# Altium project BBB_Board.PrjPCB (part 2 of 2)
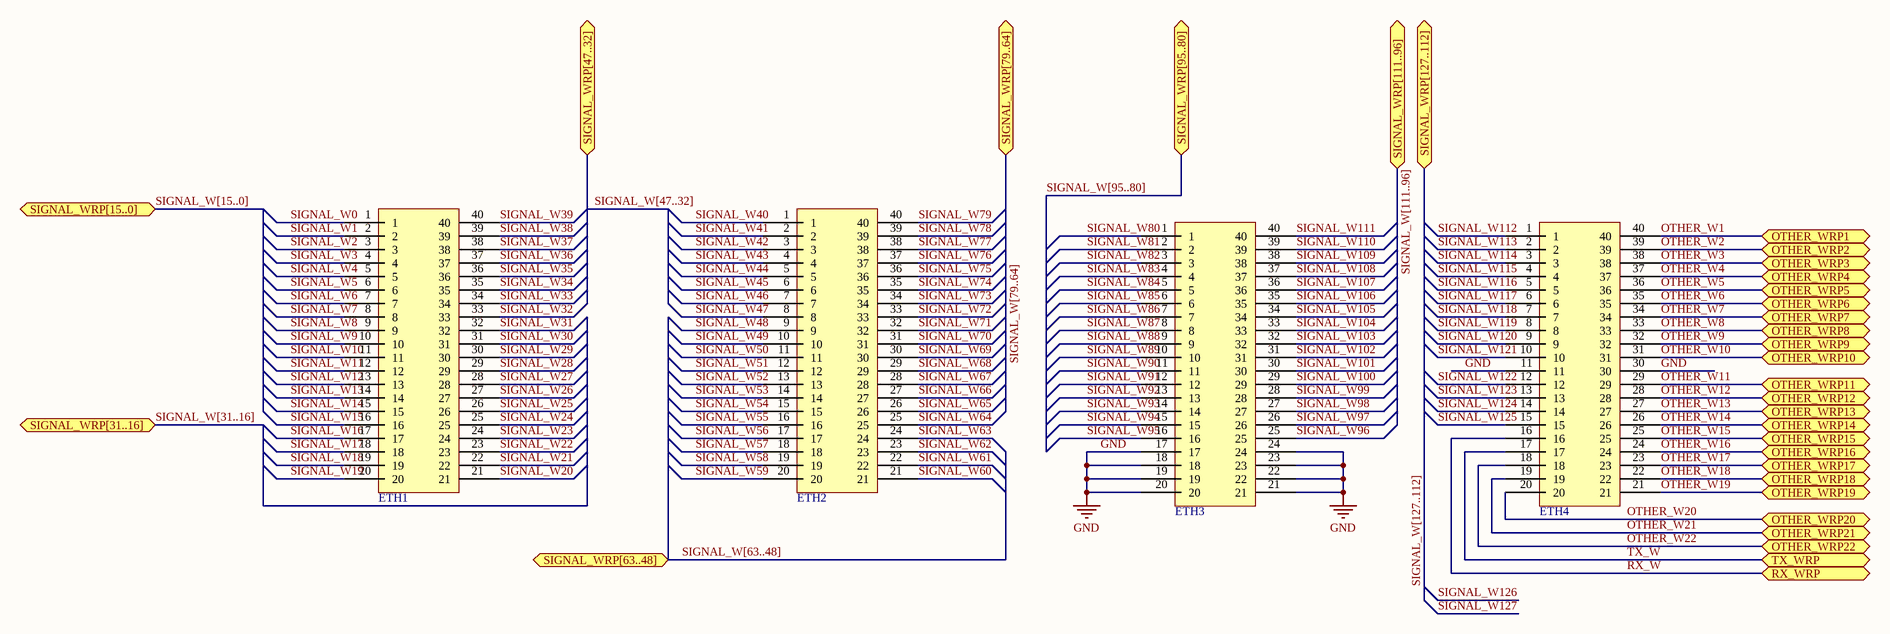
[diagram p6: NUMATO_HDR.SchDoc]

## Nets that join several sheets
GND: BBB_Board (50 pins), U_Power_Control (10 pins), U_Power_Control (10 pins), U_DUT_HEADER (DUT1_U_DUT_HEADER4.20 DUT1_U_DUT_HEADER4.21), U_DUT_HEADER (DUT1_U_DUT_HEADER2.20 DUT1_U_DUT_HEADER2.21 DUT1_U_DUT_HEADER2.22), U_DUT_HEADER (5 pins), NUMATO_HDR (10 pins)
3V3_W: BBB_Board (14 pins), U_Power_Control (0.1uF_4_U_Power_Control2.2 10k_U_Power_Control2.2 10uF_1_U_Power_Control2.2 POT_U_Power_Control2.8), U_Power_Control (0.1uF_4_U_Power_Control1.2 10k_U_Power_Control1.2 10uF_1_U_Power_Control1.2 POT_U_Power_Control1.8), U_VT_BANK/U_VT_WRP (0.1uF_0_U_VT_WRP8.1 LT1_U_VT_WRP8.2 LT2_U_VT_WRP8.2), U_VT_BANK/U_VT_WRP (0.1uF_0_U_VT_WRP7.1 LT1_U_VT_WRP7.2 LT2_U_VT_WRP7.2), U_VT_BANK/U_VT_WRP (0.1uF_0_U_VT_WRP6.1 LT1_U_VT_WRP6.2 LT2_U_VT_WRP6.2), U_VT_BANK/U_VT_WRP (0.1uF_0_U_VT_WRP5.1 LT1_U_VT_WRP5.2 LT2_U_VT_WRP5.2), U_VT_BANK/U_VT_WRP (0.1uF_0_U_VT_WRP4.1 LT1_U_VT_WRP4.2 LT2_U_VT_WRP4.2), U_VT_BANK/U_VT_WRP (0.1uF_0_U_VT_WRP3.1 LT1_U_VT_WRP3.2 LT2_U_VT_WRP3.2), U_VT_BANK/U_VT_WRP (0.1uF_0_U_VT_WRP2.1 LT1_U_VT_WRP2.2 LT2_U_VT_WRP2.2), U_VT_BANK/U_VT_WRP (0.1uF_0_U_VT_WRP1.1 LT1_U_VT_WRP1.2 LT2_U_VT_WRP1.2), U_DUT_HEADER (DUT1_U_DUT_HEADER2.19)
12V_W: BBB_Board (5 pins), U_Power_Control (5 pins), U_Power_Control (5 pins)
-5V_W: BBB_Board (5V_INVERTER.5 150uF_1.2), U_Power_Control (3MOhm_U_Power_Control2.2 LM1_U_Power_Control2.2), U_Power_Control (3MOhm_U_Power_Control1.2 LM1_U_Power_Control1.2)
COUNTER_CLK0: U_DUT_HEADER (DUT1_U_DUT_HEADER4.24), NUMATO_HDR (ETH4.35)
COUNTER_CLK1: U_DUT_HEADER (DUT1_U_DUT_HEADER3.24), NUMATO_HDR (ETH4.25)
COUNTER_CLK2: U_DUT_HEADER (DUT1_U_DUT_HEADER2.24), NUMATO_HDR (ETH4.22)
COUNTER_CLK3: U_DUT_HEADER (DUT1_U_DUT_HEADER1.24), NUMATO_HDR (ETH4.21)
COUNTER_CLR: U_DUT_HEADER (DUT1_U_DUT_HEADER4.23), NUMATO_HDR (ETH4.36)
CUSTOM_HIGH: BBB_Board (CUSTOM_HIGH.1), U_Power_Control (6 pins)
CUSTOM_LOW: BBB_Board (CUSTOM_LOW.1), U_Power_Control (6 pins)
DIN0: BBB_Board (BBB_DOWN.21), U_Power_Control (POT_U_Power_Control2.10)
DIN1: BBB_Board (BBB_DOWN.29), U_Power_Control (POT_U_Power_Control1.10)
FPGA_EN: U_VT_BANK/U_VT_WRP (LT1_U_VT_WRP8.10 LT2_U_VT_WRP8.10), U_VT_BANK/U_VT_WRP (LT1_U_VT_WRP7.10 LT2_U_VT_WRP7.10), U_VT_BANK/U_VT_WRP (LT1_U_VT_WRP6.10 LT2_U_VT_WRP6.10), U_VT_BANK/U_VT_WRP (LT1_U_VT_WRP5.10 LT2_U_VT_WRP5.10), U_VT_BANK/U_VT_WRP (LT1_U_VT_WRP4.10 LT2_U_VT_WRP4.10), U_VT_BANK/U_VT_WRP (LT1_U_VT_WRP3.10 LT2_U_VT_WRP3.10), U_VT_BANK/U_VT_WRP (LT1_U_VT_WRP2.10 LT2_U_VT_WRP2.10), U_VT_BANK/U_VT_WRP (LT1_U_VT_WRP1.10 LT2_U_VT_WRP1.10), U_DUT_HEADER (DUT1_U_DUT_HEADER4.22), NUMATO_HDR (ETH4.37)
FPGA_Q: U_DUT_HEADER (DUT1_U_DUT_HEADER3.20), NUMATO_HDR (ETH4.18)
FPGA_RX: BBB_Board (BBB_DOWN.26), NUMATO_HDR (ETH4.16)
FPGA_SHCP: U_DUT_HEADER (DUT1_U_DUT_HEADER3.22), NUMATO_HDR (ETH4.29)
FPGA_SIG0: U_VT_BANK/U_VT_WRP (LT1_U_VT_WRP8.1), NUMATO_HDR (ETH1.1)
FPGA_SIG1: U_VT_BANK/U_VT_WRP (LT1_U_VT_WRP8.3), NUMATO_HDR (ETH1.2)
FPGA_SIG2: U_VT_BANK/U_VT_WRP (LT1_U_VT_WRP8.4), NUMATO_HDR (ETH1.3)
FPGA_SIG3: U_VT_BANK/U_VT_WRP (LT1_U_VT_WRP8.5), NUMATO_HDR (ETH1.4)
FPGA_SIG4: U_VT_BANK/U_VT_WRP (LT1_U_VT_WRP8.6), NUMATO_HDR (ETH1.5)
FPGA_SIG5: U_VT_BANK/U_VT_WRP (LT1_U_VT_WRP8.7), NUMATO_HDR (ETH1.6)
FPGA_SIG6: U_VT_BANK/U_VT_WRP (LT1_U_VT_WRP8.8), NUMATO_HDR (ETH1.7)
FPGA_SIG7: U_VT_BANK/U_VT_WRP (LT1_U_VT_WRP8.9), NUMATO_HDR (ETH1.8)
FPGA_SIG8: U_VT_BANK/U_VT_WRP (LT2_U_VT_WRP8.1), NUMATO_HDR (ETH1.9)
FPGA_SIG9: U_VT_BANK/U_VT_WRP (LT2_U_VT_WRP8.3), NUMATO_HDR (ETH1.10)
FPGA_SIG10: U_VT_BANK/U_VT_WRP (LT2_U_VT_WRP8.4), NUMATO_HDR (ETH1.11)
FPGA_SIG11: U_VT_BANK/U_VT_WRP (LT2_U_VT_WRP8.5), NUMATO_HDR (ETH1.12)
FPGA_SIG12: U_VT_BANK/U_VT_WRP (LT2_U_VT_WRP8.6), NUMATO_HDR (ETH1.13)
FPGA_SIG13: U_VT_BANK/U_VT_WRP (LT2_U_VT_WRP8.7), NUMATO_HDR (ETH1.14)
FPGA_SIG14: U_VT_BANK/U_VT_WRP (LT2_U_VT_WRP8.8), NUMATO_HDR (ETH1.15)
FPGA_SIG15: U_VT_BANK/U_VT_WRP (LT2_U_VT_WRP8.9), NUMATO_HDR (ETH1.16)
FPGA_SIG16: U_VT_BANK/U_VT_WRP (LT1_U_VT_WRP7.1), NUMATO_HDR (ETH1.17)
FPGA_SIG17: U_VT_BANK/U_VT_WRP (LT1_U_VT_WRP7.3), NUMATO_HDR (ETH1.18)
FPGA_SIG18: U_VT_BANK/U_VT_WRP (LT1_U_VT_WRP7.4), NUMATO_HDR (ETH1.19)
FPGA_SIG19: U_VT_BANK/U_VT_WRP (LT1_U_VT_WRP7.5), NUMATO_HDR (ETH1.20)
FPGA_SIG20: U_VT_BANK/U_VT_WRP (LT1_U_VT_WRP7.6), NUMATO_HDR (ETH1.21)
FPGA_SIG21: U_VT_BANK/U_VT_WRP (LT1_U_VT_WRP7.7), NUMATO_HDR (ETH1.22)
FPGA_SIG22: U_VT_BANK/U_VT_WRP (LT1_U_VT_WRP7.8), NUMATO_HDR (ETH1.23)
FPGA_SIG23: U_VT_BANK/U_VT_WRP (LT1_U_VT_WRP7.9), NUMATO_HDR (ETH1.24)
FPGA_SIG24: U_VT_BANK/U_VT_WRP (LT2_U_VT_WRP7.1), NUMATO_HDR (ETH1.25)
FPGA_SIG25: U_VT_BANK/U_VT_WRP (LT2_U_VT_WRP7.3), NUMATO_HDR (ETH1.26)
FPGA_SIG26: U_VT_BANK/U_VT_WRP (LT2_U_VT_WRP7.4), NUMATO_HDR (ETH1.27)
FPGA_SIG27: U_VT_BANK/U_VT_WRP (LT2_U_VT_WRP7.5), NUMATO_HDR (ETH1.28)
FPGA_SIG28: U_VT_BANK/U_VT_WRP (LT2_U_VT_WRP7.6), NUMATO_HDR (ETH1.29)
FPGA_SIG29: U_VT_BANK/U_VT_WRP (LT2_U_VT_WRP7.7), NUMATO_HDR (ETH1.30)
FPGA_SIG30: U_VT_BANK/U_VT_WRP (LT2_U_VT_WRP7.8), NUMATO_HDR (ETH1.31)
FPGA_SIG31: U_VT_BANK/U_VT_WRP (LT2_U_VT_WRP7.9), NUMATO_HDR (ETH1.32)
FPGA_SIG32: U_VT_BANK/U_VT_WRP (LT1_U_VT_WRP6.1), NUMATO_HDR (ETH1.33)
FPGA_SIG33: U_VT_BANK/U_VT_WRP (LT1_U_VT_WRP6.3), NUMATO_HDR (ETH1.34)
FPGA_SIG34: U_VT_BANK/U_VT_WRP (LT1_U_VT_WRP6.4), NUMATO_HDR (ETH1.35)
FPGA_SIG35: U_VT_BANK/U_VT_WRP (LT1_U_VT_WRP6.5), NUMATO_HDR (ETH1.36)
FPGA_SIG36: U_VT_BANK/U_VT_WRP (LT1_U_VT_WRP6.6), NUMATO_HDR (ETH1.37)
FPGA_SIG37: U_VT_BANK/U_VT_WRP (LT1_U_VT_WRP6.7), NUMATO_HDR (ETH1.38)
FPGA_SIG38: U_VT_BANK/U_VT_WRP (LT1_U_VT_WRP6.8), NUMATO_HDR (ETH1.39)
FPGA_SIG39: U_VT_BANK/U_VT_WRP (LT1_U_VT_WRP6.9), NUMATO_HDR (ETH1.40)
FPGA_SIG40: U_VT_BANK/U_VT_WRP (LT2_U_VT_WRP6.1), NUMATO_HDR (ETH2.1)
FPGA_SIG41: U_VT_BANK/U_VT_WRP (LT2_U_VT_WRP6.3), NUMATO_HDR (ETH2.2)
FPGA_SIG42: U_VT_BANK/U_VT_WRP (LT2_U_VT_WRP6.4), NUMATO_HDR (ETH2.3)
FPGA_SIG43: U_VT_BANK/U_VT_WRP (LT2_U_VT_WRP6.5), NUMATO_HDR (ETH2.4)
FPGA_SIG44: U_VT_BANK/U_VT_WRP (LT2_U_VT_WRP6.6), NUMATO_HDR (ETH2.5)
FPGA_SIG45: U_VT_BANK/U_VT_WRP (LT2_U_VT_WRP6.7), NUMATO_HDR (ETH2.6)
FPGA_SIG46: U_VT_BANK/U_VT_WRP (LT2_U_VT_WRP6.8), NUMATO_HDR (ETH2.7)
FPGA_SIG47: U_VT_BANK/U_VT_WRP (LT2_U_VT_WRP6.9), NUMATO_HDR (ETH2.8)
FPGA_SIG48: U_VT_BANK/U_VT_WRP (LT1_U_VT_WRP5.1), NUMATO_HDR (ETH2.9)
FPGA_SIG49: U_VT_BANK/U_VT_WRP (LT1_U_VT_WRP5.3), NUMATO_HDR (ETH2.10)
FPGA_SIG50: U_VT_BANK/U_VT_WRP (LT1_U_VT_WRP5.4), NUMATO_HDR (ETH2.11)
FPGA_SIG51: U_VT_BANK/U_VT_WRP (LT1_U_VT_WRP5.5), NUMATO_HDR (ETH2.12)
FPGA_SIG52: U_VT_BANK/U_VT_WRP (LT1_U_VT_WRP5.6), NUMATO_HDR (ETH2.13)
FPGA_SIG53: U_VT_BANK/U_VT_WRP (LT1_U_VT_WRP5.7), NUMATO_HDR (ETH2.14)
FPGA_SIG54: U_VT_BANK/U_VT_WRP (LT1_U_VT_WRP5.8), NUMATO_HDR (ETH2.15)
FPGA_SIG55: U_VT_BANK/U_VT_WRP (LT1_U_VT_WRP5.9), NUMATO_HDR (ETH2.16)
FPGA_SIG56: U_VT_BANK/U_VT_WRP (LT2_U_VT_WRP5.1), NUMATO_HDR (ETH2.17)
FPGA_SIG57: U_VT_BANK/U_VT_WRP (LT2_U_VT_WRP5.3), NUMATO_HDR (ETH2.18)
FPGA_SIG58: U_VT_BANK/U_VT_WRP (LT2_U_VT_WRP5.4), NUMATO_HDR (ETH2.19)
FPGA_SIG59: U_VT_BANK/U_VT_WRP (LT2_U_VT_WRP5.5), NUMATO_HDR (ETH2.20)
FPGA_SIG60: U_VT_BANK/U_VT_WRP (LT2_U_VT_WRP5.6), NUMATO_HDR (ETH2.21)
FPGA_SIG61: U_VT_BANK/U_VT_WRP (LT2_U_VT_WRP5.7), NUMATO_HDR (ETH2.22)
FPGA_SIG62: U_VT_BANK/U_VT_WRP (LT2_U_VT_WRP5.8), NUMATO_HDR (ETH2.23)
FPGA_SIG63: U_VT_BANK/U_VT_WRP (LT2_U_VT_WRP5.9), NUMATO_HDR (ETH2.24)
FPGA_SIG64: U_VT_BANK/U_VT_WRP (LT1_U_VT_WRP4.1), NUMATO_HDR (ETH2.25)
FPGA_SIG65: U_VT_BANK/U_VT_WRP (LT1_U_VT_WRP4.3), NUMATO_HDR (ETH2.26)
FPGA_SIG66: U_VT_BANK/U_VT_WRP (LT1_U_VT_WRP4.4), NUMATO_HDR (ETH2.27)
FPGA_SIG67: U_VT_BANK/U_VT_WRP (LT1_U_VT_WRP4.5), NUMATO_HDR (ETH2.28)
FPGA_SIG68: U_VT_BANK/U_VT_WRP (LT1_U_VT_WRP4.6), NUMATO_HDR (ETH2.29)
FPGA_SIG69: U_VT_BANK/U_VT_WRP (LT1_U_VT_WRP4.7), NUMATO_HDR (ETH2.30)
FPGA_SIG70: U_VT_BANK/U_VT_WRP (LT1_U_VT_WRP4.8), NUMATO_HDR (ETH2.31)
FPGA_SIG71: U_VT_BANK/U_VT_WRP (LT1_U_VT_WRP4.9), NUMATO_HDR (ETH2.32)
FPGA_SIG72: U_VT_BANK/U_VT_WRP (LT2_U_VT_WRP4.1), NUMATO_HDR (ETH2.33)
FPGA_SIG73: U_VT_BANK/U_VT_WRP (LT2_U_VT_WRP4.3), NUMATO_HDR (ETH2.34)
FPGA_SIG74: U_VT_BANK/U_VT_WRP (LT2_U_VT_WRP4.4), NUMATO_HDR (ETH2.35)
FPGA_SIG75: U_VT_BANK/U_VT_WRP (LT2_U_VT_WRP4.5), NUMATO_HDR (ETH2.36)
FPGA_SIG76: U_VT_BANK/U_VT_WRP (LT2_U_VT_WRP4.6), NUMATO_HDR (ETH2.37)
FPGA_SIG77: U_VT_BANK/U_VT_WRP (LT2_U_VT_WRP4.7), NUMATO_HDR (ETH2.38)
FPGA_SIG78: U_VT_BANK/U_VT_WRP (LT2_U_VT_WRP4.8), NUMATO_HDR (ETH2.39)
FPGA_SIG79: U_VT_BANK/U_VT_WRP (LT2_U_VT_WRP4.9), NUMATO_HDR (ETH2.40)
FPGA_SIG80: U_VT_BANK/U_VT_WRP (LT1_U_VT_WRP3.1), NUMATO_HDR (ETH3.1)
FPGA_SIG81: U_VT_BANK/U_VT_WRP (LT1_U_VT_WRP3.3), NUMATO_HDR (ETH3.2)
FPGA_SIG82: U_VT_BANK/U_VT_WRP (LT1_U_VT_WRP3.4), NUMATO_HDR (ETH3.3)
FPGA_SIG83: U_VT_BANK/U_VT_WRP (LT1_U_VT_WRP3.5), NUMATO_HDR (ETH3.4)
FPGA_SIG84: U_VT_BANK/U_VT_WRP (LT1_U_VT_WRP3.6), NUMATO_HDR (ETH3.5)
FPGA_SIG85: U_VT_BANK/U_VT_WRP (LT1_U_VT_WRP3.7), NUMATO_HDR (ETH3.6)
FPGA_SIG86: U_VT_BANK/U_VT_WRP (LT1_U_VT_WRP3.8), NUMATO_HDR (ETH3.7)
FPGA_SIG87: U_VT_BANK/U_VT_WRP (LT1_U_VT_WRP3.9), NUMATO_HDR (ETH3.8)
FPGA_SIG88: U_VT_BANK/U_VT_WRP (LT2_U_VT_WRP3.1), NUMATO_HDR (ETH3.9)
FPGA_SIG89: U_VT_BANK/U_VT_WRP (LT2_U_VT_WRP3.3), NUMATO_HDR (ETH3.10)
FPGA_SIG90: U_VT_BANK/U_VT_WRP (LT2_U_VT_WRP3.4), NUMATO_HDR (ETH3.11)
FPGA_SIG91: U_VT_BANK/U_VT_WRP (LT2_U_VT_WRP3.5), NUMATO_HDR (ETH3.12)
FPGA_SIG92: U_VT_BANK/U_VT_WRP (LT2_U_VT_WRP3.6), NUMATO_HDR (ETH3.13)
FPGA_SIG93: U_VT_BANK/U_VT_WRP (LT2_U_VT_WRP3.7), NUMATO_HDR (ETH3.14)
FPGA_SIG94: U_VT_BANK/U_VT_WRP (LT2_U_VT_WRP3.8), NUMATO_HDR (ETH3.15)
FPGA_SIG95: U_VT_BANK/U_VT_WRP (LT2_U_VT_WRP3.9), NUMATO_HDR (ETH3.16)
FPGA_SIG96: U_VT_BANK/U_VT_WRP (LT1_U_VT_WRP2.1), NUMATO_HDR (ETH3.25)
FPGA_SIG97: U_VT_BANK/U_VT_WRP (LT1_U_VT_WRP2.3), NUMATO_HDR (ETH3.26)
FPGA_SIG98: U_VT_BANK/U_VT_WRP (LT1_U_VT_WRP2.4), NUMATO_HDR (ETH3.27)
FPGA_SIG99: U_VT_BANK/U_VT_WRP (LT1_U_VT_WRP2.5), NUMATO_HDR (ETH3.28)
FPGA_SIG100: U_VT_BANK/U_VT_WRP (LT1_U_VT_WRP2.6), NUMATO_HDR (ETH3.29)
FPGA_SIG101: U_VT_BANK/U_VT_WRP (LT1_U_VT_WRP2.7), NUMATO_HDR (ETH3.30)
FPGA_SIG102: U_VT_BANK/U_VT_WRP (LT1_U_VT_WRP2.8), NUMATO_HDR (ETH3.31)
FPGA_SIG103: U_VT_BANK/U_VT_WRP (LT1_U_VT_WRP2.9), NUMATO_HDR (ETH3.32)
FPGA_SIG104: U_VT_BANK/U_VT_WRP (LT2_U_VT_WRP2.1), NUMATO_HDR (ETH3.33)
FPGA_SIG105: U_VT_BANK/U_VT_WRP (LT2_U_VT_WRP2.3), NUMATO_HDR (ETH3.34)
FPGA_SIG106: U_VT_BANK/U_VT_WRP (LT2_U_VT_WRP2.4), NUMATO_HDR (ETH3.35)
FPGA_SIG107: U_VT_BANK/U_VT_WRP (LT2_U_VT_WRP2.5), NUMATO_HDR (ETH3.36)
FPGA_SIG108: U_VT_BANK/U_VT_WRP (LT2_U_VT_WRP2.6), NUMATO_HDR (ETH3.37)
FPGA_SIG109: U_VT_BANK/U_VT_WRP (LT2_U_VT_WRP2.7), NUMATO_HDR (ETH3.38)
FPGA_SIG110: U_VT_BANK/U_VT_WRP (LT2_U_VT_WRP2.8), NUMATO_HDR (ETH3.39)
FPGA_SIG111: U_VT_BANK/U_VT_WRP (LT2_U_VT_WRP2.9), NUMATO_HDR (ETH3.40)
FPGA_SIG112: U_VT_BANK/U_VT_WRP (LT1_U_VT_WRP1.1), NUMATO_HDR (ETH4.1)
FPGA_SIG113: U_VT_BANK/U_VT_WRP (LT1_U_VT_WRP1.3), NUMATO_HDR (ETH4.2)
FPGA_SIG114: U_VT_BANK/U_VT_WRP (LT1_U_VT_WRP1.4), NUMATO_HDR (ETH4.3)
FPGA_SIG115: U_VT_BANK/U_VT_WRP (LT1_U_VT_WRP1.5), NUMATO_HDR (ETH4.4)
FPGA_SIG116: U_VT_BANK/U_VT_WRP (LT1_U_VT_WRP1.6), NUMATO_HDR (ETH4.5)
FPGA_SIG117: U_VT_BANK/U_VT_WRP (LT1_U_VT_WRP1.7), NUMATO_HDR (ETH4.6)
FPGA_SIG118: U_VT_BANK/U_VT_WRP (LT1_U_VT_WRP1.8), NUMATO_HDR (ETH4.7)
FPGA_SIG119: U_VT_BANK/U_VT_WRP (LT1_U_VT_WRP1.9), NUMATO_HDR (ETH4.8)
FPGA_SIG120: U_VT_BANK/U_VT_WRP (LT2_U_VT_WRP1.1), NUMATO_HDR (ETH4.9)
FPGA_SIG121: U_VT_BANK/U_VT_WRP (LT2_U_VT_WRP1.3), NUMATO_HDR (ETH4.10)
FPGA_SIG122: U_VT_BANK/U_VT_WRP (LT2_U_VT_WRP1.4), NUMATO_HDR (ETH4.12)
FPGA_SIG123: U_VT_BANK/U_VT_WRP (LT2_U_VT_WRP1.5), NUMATO_HDR (ETH4.13)
FPGA_SIG124: U_VT_BANK/U_VT_WRP (LT2_U_VT_WRP1.6), NUMATO_HDR (ETH4.14)
FPGA_SIG125: U_VT_BANK/U_VT_WRP (LT2_U_VT_WRP1.7), NUMATO_HDR (ETH4.15)
FPGA_STCP: U_DUT_HEADER (DUT1_U_DUT_HEADER3.23), NUMATO_HDR (ETH4.28)
FPGA_TX: BBB_Board (BBB_DOWN.24), NUMATO_HDR (ETH4.17)
FPGA_~CS1: U_DUT_HEADER (DUT1_U_DUT_HEADER4.17), NUMATO_HDR (ETH4.40)
FPGA_~CS2: U_DUT_HEADER (DUT1_U_DUT_HEADER2.17), NUMATO_HDR (ETH4.27)
FPGA_~CS3: U_DUT_HEADER (DUT1_U_DUT_HEADER1.17), NUMATO_HDR (ETH4.24)
FPGA_~CS4: U_DUT_HEADER (DUT1_U_DUT_HEADER3.17), NUMATO_HDR (ETH4.34)
FPGA_~MR: U_DUT_HEADER (DUT1_U_DUT_HEADER3.19), NUMATO_HDR (ETH4.32)
FPGA_~OE: U_DUT_HEADER (DUT1_U_DUT_HEADER4.18), NUMATO_HDR (ETH4.39)
FPGA_~PL: U_DUT_HEADER (DUT1_U_DUT_HEADER3.21), NUMATO_HDR (ETH4.31)
FPGA_~WE1: U_DUT_HEADER (DUT1_U_DUT_HEADER4.19), NUMATO_HDR (ETH4.38)
FPGA_~WE2: U_DUT_HEADER (DUT1_U_DUT_HEADER2.18), NUMATO_HDR (ETH4.26)
FPGA_~WE3: U_DUT_HEADER (DUT1_U_DUT_HEADER1.18), NUMATO_HDR (ETH4.23)
FPGA_~WE4: U_DUT_HEADER (DUT1_U_DUT_HEADER3.18), NUMATO_HDR (ETH4.33)
GLOBAL_HIGH_POWER: BBB_Board (11 pins), U_VT_BANK/U_VT_WRP (0.1uF_4_U_VT_WRP8.1 LT1_U_VT_WRP8.19 LT2_U_VT_WRP8.19), U_VT_BANK/U_VT_WRP (0.1uF_4_U_VT_WRP7.1 LT1_U_VT_WRP7.19 LT2_U_VT_WRP7.19), U_VT_BANK/U_VT_WRP (0.1uF_4_U_VT_WRP6.1 LT1_U_VT_WRP6.19 LT2_U_VT_WRP6.19), U_VT_BANK/U_VT_WRP (0.1uF_4_U_VT_WRP5.1 LT1_U_VT_WRP5.19 LT2_U_VT_WRP5.19), U_VT_BANK/U_VT_WRP (0.1uF_4_U_VT_WRP4.1 LT1_U_VT_WRP4.19 LT2_U_VT_WRP4.19), U_VT_BANK/U_VT_WRP (0.1uF_4_U_VT_WRP3.1 LT1_U_VT_WRP3.19 LT2_U_VT_WRP3.19), U_VT_BANK/U_VT_WRP (0.1uF_4_U_VT_WRP2.1 LT1_U_VT_WRP2.19 LT2_U_VT_WRP2.19), U_VT_BANK/U_VT_WRP (0.1uF_4_U_VT_WRP1.1 LT1_U_VT_WRP1.19 LT2_U_VT_WRP1.19), U_DUT_HEADER (DUT1_U_DUT_HEADER2.23)
GLOBAL_LOW_POWER: BBB_Board (11 pins), U_VT_BANK/U_VT_WRP (0.1uF_0_U_VT_WRP8.2 0.1uF_4_U_VT_WRP8.2 LT1_U_VT_WRP8.11 LT2_U_VT_WRP8.11), U_VT_BANK/U_VT_WRP (0.1uF_0_U_VT_WRP7.2 0.1uF_4_U_VT_WRP7.2 LT1_U_VT_WRP7.11 LT2_U_VT_WRP7.11), U_VT_BANK/U_VT_WRP (0.1uF_0_U_VT_WRP6.2 0.1uF_4_U_VT_WRP6.2 LT1_U_VT_WRP6.11 LT2_U_VT_WRP6.11), U_VT_BANK/U_VT_WRP (0.1uF_0_U_VT_WRP5.2 0.1uF_4_U_VT_WRP5.2 LT1_U_VT_WRP5.11 LT2_U_VT_WRP5.11), U_VT_BANK/U_VT_WRP (0.1uF_0_U_VT_WRP4.2 0.1uF_4_U_VT_WRP4.2 LT1_U_VT_WRP4.11 LT2_U_VT_WRP4.11), U_VT_BANK/U_VT_WRP (0.1uF_0_U_VT_WRP3.2 0.1uF_4_U_VT_WRP3.2 LT1_U_VT_WRP3.11 LT2_U_VT_WRP3.11), U_VT_BANK/U_VT_WRP (0.1uF_0_U_VT_WRP2.2 0.1uF_4_U_VT_WRP2.2 LT1_U_VT_WRP2.11 LT2_U_VT_WRP2.11), U_VT_BANK/U_VT_WRP (0.1uF_0_U_VT_WRP1.2 0.1uF_4_U_VT_WRP1.2 LT1_U_VT_WRP1.11 LT2_U_VT_WRP1.11)
OTHER_W21: BBB_Board (R1.2 S1.2), NUMATO_HDR (ETH4.19)
OVCC_B0: U_VT_BANK/U_VT_WRP (LT1_U_VT_WRP8.20), U_DUT_HEADER (DUT1_U_DUT_HEADER4.1)
OVCC_B1: U_VT_BANK/U_VT_WRP (LT1_U_VT_WRP8.18), U_DUT_HEADER (DUT1_U_DUT_HEADER4.2)
OVCC_B2: U_VT_BANK/U_VT_WRP (LT1_U_VT_WRP8.17), U_DUT_HEADER (DUT1_U_DUT_HEADER4.3)
OVCC_B3: U_VT_BANK/U_VT_WRP (LT1_U_VT_WRP8.16), U_DUT_HEADER (DUT1_U_DUT_HEADER4.4)
OVCC_B4: U_VT_BANK/U_VT_WRP (LT1_U_VT_WRP8.15), U_DUT_HEADER (DUT1_U_DUT_HEADER4.5)
OVCC_B5: U_VT_BANK/U_VT_WRP (LT1_U_VT_WRP8.14), U_DUT_HEADER (DUT1_U_DUT_HEADER4.6)
OVCC_B6: U_VT_BANK/U_VT_WRP (LT1_U_VT_WRP8.13), U_DUT_HEADER (DUT1_U_DUT_HEADER4.7)
OVCC_B7: U_VT_BANK/U_VT_WRP (LT1_U_VT_WRP8.12), U_DUT_HEADER (DUT1_U_DUT_HEADER4.8)
OVCC_B8: U_VT_BANK/U_VT_WRP (LT2_U_VT_WRP8.20), U_DUT_HEADER (DUT1_U_DUT_HEADER4.9)
OVCC_B9: U_VT_BANK/U_VT_WRP (LT2_U_VT_WRP8.18), U_DUT_HEADER (DUT1_U_DUT_HEADER4.10)
OVCC_B10: U_VT_BANK/U_VT_WRP (LT2_U_VT_WRP8.17), U_DUT_HEADER (DUT1_U_DUT_HEADER4.11)
OVCC_B11: U_VT_BANK/U_VT_WRP (LT2_U_VT_WRP8.16), U_DUT_HEADER (DUT1_U_DUT_HEADER4.12)
OVCC_B12: U_VT_BANK/U_VT_WRP (LT2_U_VT_WRP8.15), U_DUT_HEADER (DUT1_U_DUT_HEADER4.13)
OVCC_B13: U_VT_BANK/U_VT_WRP (LT2_U_VT_WRP8.14), U_DUT_HEADER (DUT1_U_DUT_HEADER4.14)
OVCC_B14: U_VT_BANK/U_VT_WRP (LT2_U_VT_WRP8.13), U_DUT_HEADER (DUT1_U_DUT_HEADER4.15)
OVCC_B15: U_VT_BANK/U_VT_WRP (LT2_U_VT_WRP8.12), U_DUT_HEADER (DUT1_U_DUT_HEADER4.16)
OVCC_B16: U_VT_BANK/U_VT_WRP (LT1_U_VT_WRP7.20), U_DUT_HEADER (DUT1_U_DUT_HEADER4.25)
OVCC_B17: U_VT_BANK/U_VT_WRP (LT1_U_VT_WRP7.18), U_DUT_HEADER (DUT1_U_DUT_HEADER4.26)
OVCC_B18: U_VT_BANK/U_VT_WRP (LT1_U_VT_WRP7.17), U_DUT_HEADER (DUT1_U_DUT_HEADER4.27)
OVCC_B19: U_VT_BANK/U_VT_WRP (LT1_U_VT_WRP7.16), U_DUT_HEADER (DUT1_U_DUT_HEADER4.28)
OVCC_B20: U_VT_BANK/U_VT_WRP (LT1_U_VT_WRP7.15), U_DUT_HEADER (DUT1_U_DUT_HEADER4.29)
OVCC_B21: U_VT_BANK/U_VT_WRP (LT1_U_VT_WRP7.14), U_DUT_HEADER (DUT1_U_DUT_HEADER4.30)
OVCC_B22: U_VT_BANK/U_VT_WRP (LT1_U_VT_WRP7.13), U_DUT_HEADER (DUT1_U_DUT_HEADER4.31)
OVCC_B23: U_VT_BANK/U_VT_WRP (LT1_U_VT_WRP7.12), U_DUT_HEADER (DUT1_U_DUT_HEADER4.32)
OVCC_B24: U_VT_BANK/U_VT_WRP (LT2_U_VT_WRP7.20), U_DUT_HEADER (DUT1_U_DUT_HEADER4.33)
OVCC_B25: U_VT_BANK/U_VT_WRP (LT2_U_VT_WRP7.18), U_DUT_HEADER (DUT1_U_DUT_HEADER4.34)
OVCC_B26: U_VT_BANK/U_VT_WRP (LT2_U_VT_WRP7.17), U_DUT_HEADER (DUT1_U_DUT_HEADER4.35)
OVCC_B27: U_VT_BANK/U_VT_WRP (LT2_U_VT_WRP7.16), U_DUT_HEADER (DUT1_U_DUT_HEADER4.36)
OVCC_B28: U_VT_BANK/U_VT_WRP (LT2_U_VT_WRP7.15), U_DUT_HEADER (DUT1_U_DUT_HEADER4.37)
OVCC_B29: U_VT_BANK/U_VT_WRP (LT2_U_VT_WRP7.14), U_DUT_HEADER (DUT1_U_DUT_HEADER4.38)
OVCC_B30: U_VT_BANK/U_VT_WRP (LT2_U_VT_WRP7.13), U_DUT_HEADER (DUT1_U_DUT_HEADER4.39)
OVCC_B31: U_VT_BANK/U_VT_WRP (LT2_U_VT_WRP7.12), U_DUT_HEADER (DUT1_U_DUT_HEADER4.40)
OVCC_B32: U_VT_BANK/U_VT_WRP (LT1_U_VT_WRP6.20), U_DUT_HEADER (DUT1_U_DUT_HEADER3.1)
OVCC_B33: U_VT_BANK/U_VT_WRP (LT1_U_VT_WRP6.18), U_DUT_HEADER (DUT1_U_DUT_HEADER3.2)
OVCC_B34: U_VT_BANK/U_VT_WRP (LT1_U_VT_WRP6.17), U_DUT_HEADER (DUT1_U_DUT_HEADER3.3)
OVCC_B35: U_VT_BANK/U_VT_WRP (LT1_U_VT_WRP6.16), U_DUT_HEADER (DUT1_U_DUT_HEADER3.4)
OVCC_B36: U_VT_BANK/U_VT_WRP (LT1_U_VT_WRP6.15), U_DUT_HEADER (DUT1_U_DUT_HEADER3.5)
OVCC_B37: U_VT_BANK/U_VT_WRP (LT1_U_VT_WRP6.14), U_DUT_HEADER (DUT1_U_DUT_HEADER3.6)
OVCC_B38: U_VT_BANK/U_VT_WRP (LT1_U_VT_WRP6.13), U_DUT_HEADER (DUT1_U_DUT_HEADER3.7)
OVCC_B39: U_VT_BANK/U_VT_WRP (LT1_U_VT_WRP6.12), U_DUT_HEADER (DUT1_U_DUT_HEADER3.8)
OVCC_B40: U_VT_BANK/U_VT_WRP (LT2_U_VT_WRP6.20), U_DUT_HEADER (DUT1_U_DUT_HEADER3.9)
OVCC_B41: U_VT_BANK/U_VT_WRP (LT2_U_VT_WRP6.18), U_DUT_HEADER (DUT1_U_DUT_HEADER3.10)
OVCC_B42: U_VT_BANK/U_VT_WRP (LT2_U_VT_WRP6.17), U_DUT_HEADER (DUT1_U_DUT_HEADER3.11)
OVCC_B43: U_VT_BANK/U_VT_WRP (LT2_U_VT_WRP6.16), U_DUT_HEADER (DUT1_U_DUT_HEADER3.12)
OVCC_B44: U_VT_BANK/U_VT_WRP (LT2_U_VT_WRP6.15), U_DUT_HEADER (DUT1_U_DUT_HEADER3.13)
OVCC_B45: U_VT_BANK/U_VT_WRP (LT2_U_VT_WRP6.14), U_DUT_HEADER (DUT1_U_DUT_HEADER3.14)
OVCC_B46: U_VT_BANK/U_VT_WRP (LT2_U_VT_WRP6.13), U_DUT_HEADER (DUT1_U_DUT_HEADER3.15)
OVCC_B47: U_VT_BANK/U_VT_WRP (LT2_U_VT_WRP6.12), U_DUT_HEADER (DUT1_U_DUT_HEADER3.16)
OVCC_B48: U_VT_BANK/U_VT_WRP (LT1_U_VT_WRP5.20), U_DUT_HEADER (DUT1_U_DUT_HEADER3.25)
OVCC_B49: U_VT_BANK/U_VT_WRP (LT1_U_VT_WRP5.18), U_DUT_HEADER (DUT1_U_DUT_HEADER3.26)
OVCC_B50: U_VT_BANK/U_VT_WRP (LT1_U_VT_WRP5.17), U_DUT_HEADER (DUT1_U_DUT_HEADER3.27)
OVCC_B51: U_VT_BANK/U_VT_WRP (LT1_U_VT_WRP5.16), U_DUT_HEADER (DUT1_U_DUT_HEADER3.28)
OVCC_B52: U_VT_BANK/U_VT_WRP (LT1_U_VT_WRP5.15), U_DUT_HEADER (DUT1_U_DUT_HEADER3.29)
OVCC_B53: U_VT_BANK/U_VT_WRP (LT1_U_VT_WRP5.14), U_DUT_HEADER (DUT1_U_DUT_HEADER3.30)
OVCC_B54: U_VT_BANK/U_VT_WRP (LT1_U_VT_WRP5.13), U_DUT_HEADER (DUT1_U_DUT_HEADER3.31)
OVCC_B55: U_VT_BANK/U_VT_WRP (LT1_U_VT_WRP5.12), U_DUT_HEADER (DUT1_U_DUT_HEADER3.32)
OVCC_B56: U_VT_BANK/U_VT_WRP (LT2_U_VT_WRP5.20), U_DUT_HEADER (DUT1_U_DUT_HEADER3.33)
OVCC_B57: U_VT_BANK/U_VT_WRP (LT2_U_VT_WRP5.18), U_DUT_HEADER (DUT1_U_DUT_HEADER3.34)
OVCC_B58: U_VT_BANK/U_VT_WRP (LT2_U_VT_WRP5.17), U_DUT_HEADER (DUT1_U_DUT_HEADER3.35)
OVCC_B59: U_VT_BANK/U_VT_WRP (LT2_U_VT_WRP5.16), U_DUT_HEADER (DUT1_U_DUT_HEADER3.36)
OVCC_B60: U_VT_BANK/U_VT_WRP (LT2_U_VT_WRP5.15), U_DUT_HEADER (DUT1_U_DUT_HEADER3.37)
OVCC_B61: U_VT_BANK/U_VT_WRP (LT2_U_VT_WRP5.14), U_DUT_HEADER (DUT1_U_DUT_HEADER3.38)
OVCC_B62: U_VT_BANK/U_VT_WRP (LT2_U_VT_WRP5.13), U_DUT_HEADER (DUT1_U_DUT_HEADER3.39)
OVCC_B63: U_VT_BANK/U_VT_WRP (LT2_U_VT_WRP5.12), U_DUT_HEADER (DUT1_U_DUT_HEADER3.40)
OVCC_B64: U_VT_BANK/U_VT_WRP (LT1_U_VT_WRP4.20), U_DUT_HEADER (DUT1_U_DUT_HEADER2.1)
OVCC_B65: U_VT_BANK/U_VT_WRP (LT1_U_VT_WRP4.18), U_DUT_HEADER (DUT1_U_DUT_HEADER2.2)
OVCC_B66: U_VT_BANK/U_VT_WRP (LT1_U_VT_WRP4.17), U_DUT_HEADER (DUT1_U_DUT_HEADER2.3)
OVCC_B67: U_VT_BANK/U_VT_WRP (LT1_U_VT_WRP4.16), U_DUT_HEADER (DUT1_U_DUT_HEADER2.4)
OVCC_B68: U_VT_BANK/U_VT_WRP (LT1_U_VT_WRP4.15), U_DUT_HEADER (DUT1_U_DUT_HEADER2.5)
OVCC_B69: U_VT_BANK/U_VT_WRP (LT1_U_VT_WRP4.14), U_DUT_HEADER (DUT1_U_DUT_HEADER2.6)
OVCC_B70: U_VT_BANK/U_VT_WRP (LT1_U_VT_WRP4.13), U_DUT_HEADER (DUT1_U_DUT_HEADER2.7)
OVCC_B71: U_VT_BANK/U_VT_WRP (LT1_U_VT_WRP4.12), U_DUT_HEADER (DUT1_U_DUT_HEADER2.8)
OVCC_B72: U_VT_BANK/U_VT_WRP (LT2_U_VT_WRP4.20), U_DUT_HEADER (DUT1_U_DUT_HEADER2.9)
OVCC_B73: U_VT_BANK/U_VT_WRP (LT2_U_VT_WRP4.18), U_DUT_HEADER (DUT1_U_DUT_HEADER2.10)
OVCC_B74: U_VT_BANK/U_VT_WRP (LT2_U_VT_WRP4.17), U_DUT_HEADER (DUT1_U_DUT_HEADER2.11)
OVCC_B75: U_VT_BANK/U_VT_WRP (LT2_U_VT_WRP4.16), U_DUT_HEADER (DUT1_U_DUT_HEADER2.12)
OVCC_B76: U_VT_BANK/U_VT_WRP (LT2_U_VT_WRP4.15), U_DUT_HEADER (DUT1_U_DUT_HEADER2.13)
OVCC_B77: U_VT_BANK/U_VT_WRP (LT2_U_VT_WRP4.14), U_DUT_HEADER (DUT1_U_DUT_HEADER2.14)
OVCC_B78: U_VT_BANK/U_VT_WRP (LT2_U_VT_WRP4.13), U_DUT_HEADER (DUT1_U_DUT_HEADER2.15)
OVCC_B79: U_VT_BANK/U_VT_WRP (LT2_U_VT_WRP4.12), U_DUT_HEADER (DUT1_U_DUT_HEADER2.16)
OVCC_B80: U_VT_BANK/U_VT_WRP (LT1_U_VT_WRP3.20), U_DUT_HEADER (DUT1_U_DUT_HEADER2.25)
OVCC_B81: U_VT_BANK/U_VT_WRP (LT1_U_VT_WRP3.18), U_DUT_HEADER (DUT1_U_DUT_HEADER2.26)
OVCC_B82: U_VT_BANK/U_VT_WRP (LT1_U_VT_WRP3.17), U_DUT_HEADER (DUT1_U_DUT_HEADER2.27)
OVCC_B83: U_VT_BANK/U_VT_WRP (LT1_U_VT_WRP3.16), U_DUT_HEADER (DUT1_U_DUT_HEADER2.28)
OVCC_B84: U_VT_BANK/U_VT_WRP (LT1_U_VT_WRP3.15), U_DUT_HEADER (DUT1_U_DUT_HEADER2.29)
OVCC_B85: U_VT_BANK/U_VT_WRP (LT1_U_VT_WRP3.14), U_DUT_HEADER (DUT1_U_DUT_HEADER2.30)
OVCC_B86: U_VT_BANK/U_VT_WRP (LT1_U_VT_WRP3.13), U_DUT_HEADER (DUT1_U_DUT_HEADER2.31)
OVCC_B87: U_VT_BANK/U_VT_WRP (LT1_U_VT_WRP3.12), U_DUT_HEADER (DUT1_U_DUT_HEADER2.32)
OVCC_B88: U_VT_BANK/U_VT_WRP (LT2_U_VT_WRP3.20), U_DUT_HEADER (DUT1_U_DUT_HEADER2.33)
OVCC_B89: U_VT_BANK/U_VT_WRP (LT2_U_VT_WRP3.18), U_DUT_HEADER (DUT1_U_DUT_HEADER2.34)
OVCC_B90: U_VT_BANK/U_VT_WRP (LT2_U_VT_WRP3.17), U_DUT_HEADER (DUT1_U_DUT_HEADER2.35)
OVCC_B91: U_VT_BANK/U_VT_WRP (LT2_U_VT_WRP3.16), U_DUT_HEADER (DUT1_U_DUT_HEADER2.36)
OVCC_B92: U_VT_BANK/U_VT_WRP (LT2_U_VT_WRP3.15), U_DUT_HEADER (DUT1_U_DUT_HEADER2.37)
OVCC_B93: U_VT_BANK/U_VT_WRP (LT2_U_VT_WRP3.14), U_DUT_HEADER (DUT1_U_DUT_HEADER2.38)
OVCC_B94: U_VT_BANK/U_VT_WRP (LT2_U_VT_WRP3.13), U_DUT_HEADER (DUT1_U_DUT_HEADER2.39)
OVCC_B95: U_VT_BANK/U_VT_WRP (LT2_U_VT_WRP3.12), U_DUT_HEADER (DUT1_U_DUT_HEADER2.40)
OVCC_B96: U_VT_BANK/U_VT_WRP (LT1_U_VT_WRP2.20), U_DUT_HEADER (DUT1_U_DUT_HEADER1.1)
OVCC_B97: U_VT_BANK/U_VT_WRP (LT1_U_VT_WRP2.18), U_DUT_HEADER (DUT1_U_DUT_HEADER1.2)
OVCC_B98: U_VT_BANK/U_VT_WRP (LT1_U_VT_WRP2.17), U_DUT_HEADER (DUT1_U_DUT_HEADER1.3)
OVCC_B99: U_VT_BANK/U_VT_WRP (LT1_U_VT_WRP2.16), U_DUT_HEADER (DUT1_U_DUT_HEADER1.4)
OVCC_B100: U_VT_BANK/U_VT_WRP (LT1_U_VT_WRP2.15), U_DUT_HEADER (DUT1_U_DUT_HEADER1.5)
OVCC_B101: U_VT_BANK/U_VT_WRP (LT1_U_VT_WRP2.14), U_DUT_HEADER (DUT1_U_DUT_HEADER1.6)
OVCC_B102: U_VT_BANK/U_VT_WRP (LT1_U_VT_WRP2.13), U_DUT_HEADER (DUT1_U_DUT_HEADER1.7)
OVCC_B103: U_VT_BANK/U_VT_WRP (LT1_U_VT_WRP2.12), U_DUT_HEADER (DUT1_U_DUT_HEADER1.8)
OVCC_B104: U_VT_BANK/U_VT_WRP (LT2_U_VT_WRP2.20), U_DUT_HEADER (DUT1_U_DUT_HEADER1.9)
OVCC_B105: U_VT_BANK/U_VT_WRP (LT2_U_VT_WRP2.18), U_DUT_HEADER (DUT1_U_DUT_HEADER1.10)
OVCC_B106: U_VT_BANK/U_VT_WRP (LT2_U_VT_WRP2.17), U_DUT_HEADER (DUT1_U_DUT_HEADER1.11)
OVCC_B107: U_VT_BANK/U_VT_WRP (LT2_U_VT_WRP2.16), U_DUT_HEADER (DUT1_U_DUT_HEADER1.12)
OVCC_B108: U_VT_BANK/U_VT_WRP (LT2_U_VT_WRP2.15), U_DUT_HEADER (DUT1_U_DUT_HEADER1.13)
OVCC_B109: U_VT_BANK/U_VT_WRP (LT2_U_VT_WRP2.14), U_DUT_HEADER (DUT1_U_DUT_HEADER1.14)
OVCC_B110: U_VT_BANK/U_VT_WRP (LT2_U_VT_WRP2.13), U_DUT_HEADER (DUT1_U_DUT_HEADER1.15)
OVCC_B111: U_VT_BANK/U_VT_WRP (LT2_U_VT_WRP2.12), U_DUT_HEADER (DUT1_U_DUT_HEADER1.16)
OVCC_B112: U_VT_BANK/U_VT_WRP (LT1_U_VT_WRP1.20), U_DUT_HEADER (DUT1_U_DUT_HEADER1.25)
OVCC_B113: U_VT_BANK/U_VT_WRP (LT1_U_VT_WRP1.18), U_DUT_HEADER (DUT1_U_DUT_HEADER1.26)
OVCC_B114: U_VT_BANK/U_VT_WRP (LT1_U_VT_WRP1.17), U_DUT_HEADER (DUT1_U_DUT_HEADER1.27)
OVCC_B115: U_VT_BANK/U_VT_WRP (LT1_U_VT_WRP1.16), U_DUT_HEADER (DUT1_U_DUT_HEADER1.28)
OVCC_B116: U_VT_BANK/U_VT_WRP (LT1_U_VT_WRP1.15), U_DUT_HEADER (DUT1_U_DUT_HEADER1.29)
OVCC_B117: U_VT_BANK/U_VT_WRP (LT1_U_VT_WRP1.14), U_DUT_HEADER (DUT1_U_DUT_HEADER1.30)
OVCC_B118: U_VT_BANK/U_VT_WRP (LT1_U_VT_WRP1.13), U_DUT_HEADER (DUT1_U_DUT_HEADER1.31)
OVCC_B119: U_VT_BANK/U_VT_WRP (LT1_U_VT_WRP1.12), U_DUT_HEADER (DUT1_U_DUT_HEADER1.32)
OVCC_B120: U_VT_BANK/U_VT_WRP (LT2_U_VT_WRP1.20), U_DUT_HEADER (DUT1_U_DUT_HEADER1.33)
OVCC_B121: U_VT_BANK/U_VT_WRP (LT2_U_VT_WRP1.18), U_DUT_HEADER (DUT1_U_DUT_HEADER1.34)
OVCC_B122: U_VT_BANK/U_VT_WRP (LT2_U_VT_WRP1.17), U_DUT_HEADER (DUT1_U_DUT_HEADER1.35)
OVCC_B123: U_VT_BANK/U_VT_WRP (LT2_U_VT_WRP1.16), U_DUT_HEADER (DUT1_U_DUT_HEADER1.36)
OVCC_B124: U_VT_BANK/U_VT_WRP (LT2_U_VT_WRP1.15), U_DUT_HEADER (DUT1_U_DUT_HEADER1.37)
OVCC_B125: U_VT_BANK/U_VT_WRP (LT2_U_VT_WRP1.14), U_DUT_HEADER (DUT1_U_DUT_HEADER1.38)
OVCC_B126: U_VT_BANK/U_VT_WRP (LT2_U_VT_WRP1.13), U_DUT_HEADER (DUT1_U_DUT_HEADER1.39)
OVCC_B127: U_VT_BANK/U_VT_WRP (LT2_U_VT_WRP1.12), U_DUT_HEADER (DUT1_U_DUT_HEADER1.40)
RDY0: BBB_Board (BBB_DOWN.15), U_Power_Control (POT_U_Power_Control2.14)
RDY1: BBB_Board (BBB_DOWN.23), U_Power_Control (POT_U_Power_Control1.14)
SCLK_W: BBB_Board (BBB_DOWN.22), U_Power_Control (POT_U_Power_Control2.11)
SDO_W: BBB_Board (BBB_DOWN.18), U_Power_Control (10k_U_Power_Control2.1 POT_U_Power_Control2.13)
SDO_W: BBB_Board (BBB_DOWN.30), U_Power_Control (10k_U_Power_Control1.1 POT_U_Power_Control1.13)
SPICS0: BBB_Board (BBB_DOWN.17), U_Power_Control (POT_U_Power_Control2.12)
SPICS1: BBB_Board (BBB_DOWN.28), U_Power_Control (POT_U_Power_Control1.12)
V_RST: BBB_Board (BBB_DOWN.12), U_Power_Control (POT_U_Power_Control2.1), U_Power_Control (POT_U_Power_Control1.1)